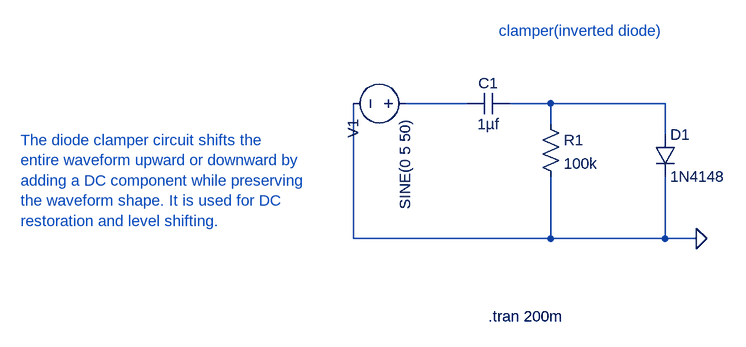
[diagram p0: schematic Clamper.asc]
Clamper.asc, the LTspice schematic file:
Version 4.1
SHEET 1 880 680
WIRE -16 16 -112 16
WIRE 112 16 48 16
WIRE 288 16 112 16
WIRE 112 48 112 16
WIRE 288 64 288 16
WIRE -192 224 -192 16
WIRE 112 224 112 128
WIRE 112 224 -192 224
WIRE 288 224 288 128
WIRE 288 224 112 224
WIRE 336 224 288 224
FLAG 336 224 0
SYMBOL voltage -96 16 R90
WINDOW 0 24 96 Left 2
WINDOW 3 24 16 Left 2
WINDOW 123 0 0 Left 0
WINDOW 39 0 0 Left 0
SYMATTR InstName V1
SYMATTR Value SINE(0 5 50)
SYMBOL cap 48 0 R90
WINDOW 0 0 32 VBottom 2
WINDOW 3 32 32 VTop 2
SYMATTR InstName C1
SYMATTR Value 1µf
SYMBOL res 96 32 R0
SYMATTR InstName R1
SYMATTR Value 100k
SYMBOL diode 272 64 R0
SYMATTR InstName D1
SYMATTR Value 1N4148
TEXT 32 -96 Left 2 ;clamper(inverted diode)
TEXT 16 344 Left 2 !.tran 200m
TEXT -704 72 Left 2 ;The diode clamper circuit shifts the\nentire waveform upward or downward by\nadding a DC component while preserving\nthe waveform shape. It is used for DC\nrestoration and level shifting.

The netlist it stands for:
* Clamper.asc
V1 N001 0 SINE(0 5 50)
C1 N002 N001 1µf
R1 N002 0 100k
D1 N002 0 1N4148
.model D D
.lib standard.dio
* clamper(inverted diode)
.tran 200m
* The diode clamper circuit shifts the
* entire waveform upward or downward by
* adding a DC component while preserving
* the waveform shape. It is used for DC
* restoration and level shifting.
.backanno
.end